# Altium project PCB_Project.PrjPcb
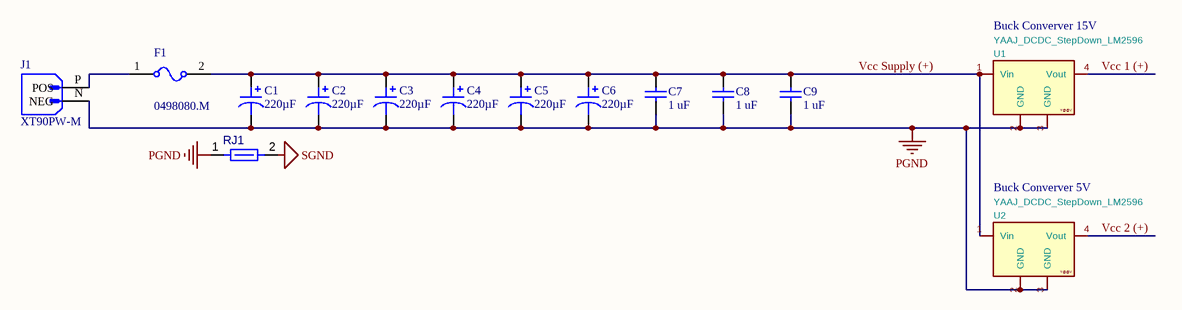
[diagram p0: Supply.SchDoc]
4 sheets, 72 parts. Net scope: global (net labels, ports and power ports of the same name join across sheets).
Board file: PCB.PcbDoc
Sheets:
  Supply.SchDoc
  Control.SchDoc
  Sensors.SchDoc
  Power.SchDoc

## Sheet Supply.SchDoc
size A4; SheetNumber: 1; SheetTotal: 4

### Parts
C1  220µF  [CAP TH ALUM ELEC D10.00mm S5.00mm H20.00mm]
C2  220µF  [CAP TH ALUM ELEC D10.00mm S5.00mm H20.00mm]
C3  220µF  [CAP TH ALUM ELEC D10.00mm S5.00mm H20.00mm]
C4  220µF  [CAP TH ALUM ELEC D10.00mm S5.00mm H20.00mm]
C5  220µF  [CAP TH ALUM ELEC D10.00mm S5.00mm H20.00mm]
C6  220µF  [CAP TH ALUM ELEC D10.00mm S5.00mm H20.00mm]
C7  1 uF  [CAPR51-254-508X318X736]
C8  1 uF  [CAPR51-254-508X318X736]
C9  1 uF  [CAPR51-254-508X318X736]
F1  0498080.M  [0498080M]
J1  XT90PW-M  [AMASS_XT90PW-M]
RJ1  Net Tie 0.6x1.4mm  [SHORT10_8MIL-FP]  (value not drawn)  (net tie, no BOM)
U1  Buck Converver 15V  value YAAJ_DCDC_StepDown_LM2596  [YAAJ_DCDC_StepDown_LM2596]
U2  Buck Converver 5V  value YAAJ_DCDC_StepDown_LM2596  [YAAJ_DCDC_StepDown_LM2596]

### Nets
PGND: C1.2 C2.2 C3.2 C4.2 C5.2 C6.2 C7.1 C8.1 C9.1 J1.N(NEG) RJ1.1 U1.2(GND) U1.3(GND) U2.2(GND) U2.3(GND)
SGND: RJ1.2
Vcc 1 (+): U1.4(Vout)
Vcc 2 (+): U2.4(Vout)
Vcc Supply (+): C1.1 C2.1 C3.1 C4.1 C5.1 C6.1 C7.2 C8.2 C9.2 F1.2 U1.1(Vin) U2.1(Vin)
NetF1_1: F1.1 J1.P(POS)

### Notes on the sheet
- (in symbol YAAJ_DCDC_StepDown_LM2596) Y@@V

### Library data of the parts
C1 C3-C6 = UPW1J221MPD: CAP ALUM 220UF 20% 63V RADIAL; manufacturer: Nichicon; Impedance: 147 mOhms; Lifetime @ Temp.: 5000 Hrs @ 105°C; Polarization: Polar; Ripple Current @ High Frequency: 885mA @ 100kHz; Ripple Current @ Low Frequency: 575.25mA @ 120Hz; Part Number: UPW1J221MPD; Applications: General Purpose; Capacitance: 220µF; componentlink1description: Datasheet; componentlink1url: http://nichicon-us.com/english/products/pdfs/e-upw.pdf; componentlink2description: DigiKey Link; componentlink2url: http://digikey.com/product-detail/en/nichicon/UPW1J221MPD/493-1942-ND/589683; Device Package: Radial, Can; Height - Seated (Max): 0.787" (20.00mm); lastupdated: 02/09/2020 01:31:30; Lead Spacing: 0.197" (5.00mm); Lifecycle Status: Active; Minimum Order: 1; Mounting Type: Through Hole; Operating Temperature: -55°C ~ 105°C; Package / Case: Radial, Can; packaging: Bulk; partid: 12422; Part Status: Active; price: 0.65; series: UPW; Size / Dimension: 0.394" Dia (10.00mm); Supplier 1: DigiKey; Supplier Part Number 1: 493-1942-ND; Tolerance: ±20%; value: 220µF; Voltage - Rated: 63V
C2 = UPW1J221MPD: UPW1J221MPD / CAP ALUM 220UF 20% 63V RADIAL; manufacturer: Nichicon; Impedance: 147 mOhms; Lifetime @ Temp.: 5000 Hrs @ 105°C; Polarization: Polar; Ripple Current @ High Frequency: 885mA @ 100kHz; Ripple Current @ Low Frequency: 575.25mA @ 120Hz; Part Number: UPW1J221MPD; Applications: General Purpose; Capacitance: 220µF; componentlink1description: Datasheet; componentlink1url: http://nichicon-us.com/english/products/pdfs/e-upw.pdf; componentlink2description: DigiKey Link; componentlink2url: http://digikey.com/product-detail/en/nichicon/UPW1J221MPD/493-1942-ND/589683; Device Package: Radial, Can; Height - Seated (Max): 0.787" (20.00mm); lastupdated: 02/09/2020 01:31:30; Lead Spacing: 0.197" (5.00mm); Lifecycle Status: Active; Minimum Order: 1; Mounting Type: Through Hole; Operating Temperature: -55°C ~ 105°C; Package / Case: Radial, Can; packaging: Bulk; partid: 12422; Part Status: Active; price: 0.65; series: UPW; Size / Dimension: 0.394" Dia (10.00mm); Supplier 1: DigiKey; Supplier Part Number 1: 493-1942-ND; Tolerance: ±20%; value: 220µF; Voltage - Rated: 63V
C7-C9 = CMP-1664-00004-1: Radial Leaded Multilayer Ceramic Capacitor, 0.1 uF, +/- 10%, 50 V, -55 to 125 degC, 2-Pin THD, RoHS, Tape and Reel; Case\Package: SOT-23-5; Max Power Dissipation: 250 mW; Output Current: 150 mA; Dropout Voltage: 260 mV; Outputs: 1; Output Voltage: 5 V; Max Input Voltage: 8 V; Min Operating Temperature: -40 degC; Packaging: Tape and Reel; Height: 1.3 mm; Radiation Hardening: No; Pins: 5; ComponentLink1Description: Manufacturer URL; Mount: Surface Mount; RoHSCompliant: true; Max Operating Temperature: 85 degC; PackageReference: CAPR51-254-508X318X736; ComponentLink2URL: http://www.kemet.com/docfinder?Partnumber=C320C104K5R5TA; PackageDescription: 2-Pin Through Hole Device, Body 5.08 x 3.18 mm, Pitch 2.54 mm; ComponentLink1URL: http://www.kemet.com/; Width: 1.8 mm; Package Quantity: 3000; DatasheetVersion: Dec-15; Length: 3 mm; ComponentLink2Description: Datasheet
F1 = Fuse: 80 A 32 V Fuse Automotive Bolt Mount Auto Link; RESISTANCE: 1m; SimulationGenericComponent: True; CURRENT: 80
J1 = XT90PW-M: Socket; DC supply; XT90; male; PIN: 2; on PCBs; THT; Colour: yellow; MF: AMASS; SnapEDA_Link: https://www.snapeda.com/parts/XT90PW-M/AMASS/view-part/?ref=snap; Package: Package; Value: *; MP: XT90PW-M; Check_prices: https://www.snapeda.com/parts/XT90PW-M/AMASS/view-part/?ref=eda
RJ1 = CMP-009-00120-2: Max Operating Temperature: 155°C; Min Operating Temperature: -55°C; Pins: 2
U1 U2 = YAAJ_DCDC_StepDown_LM2596

## Sheet Control.SchDoc
size A4; SheetNumber: 2; SheetTotal: 4
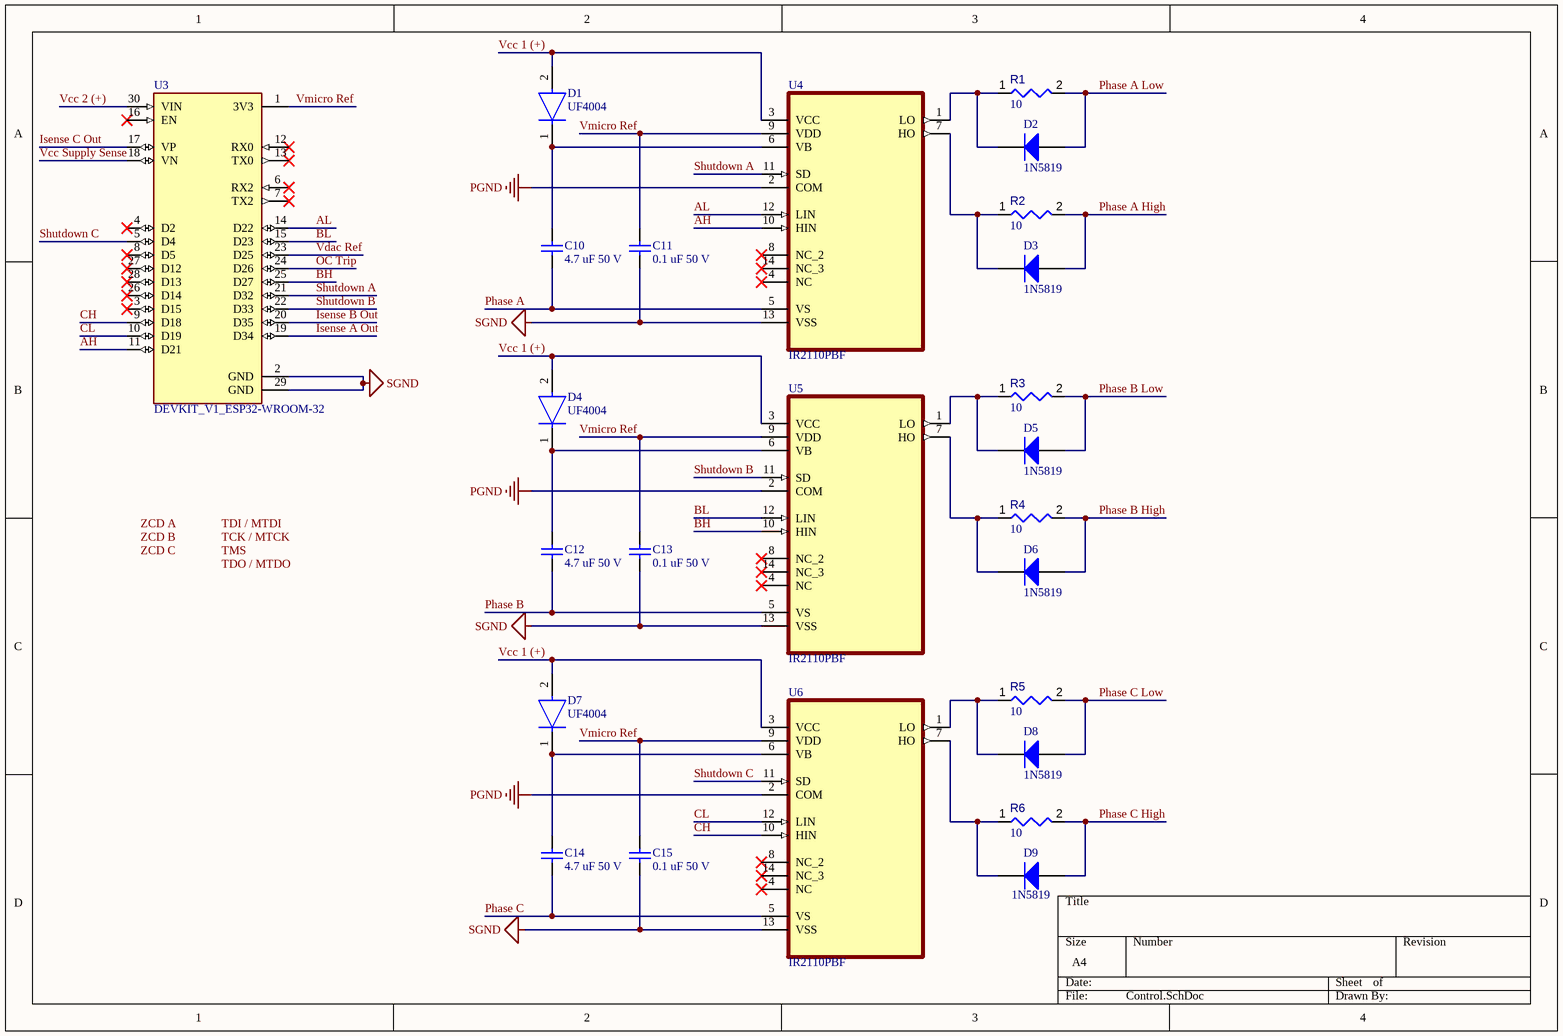
[diagram p1: Control.SchDoc]

### Parts
C10  4.7 uF 50 V  [CAPR51-254-508X318X736]
C11  0.1 uF 50 V  [CAPR51-254-508X318X736]
C12  4.7 uF 50 V  [CAPR51-254-508X318X736]
C13  0.1 uF 50 V  [CAPR51-254-508X318X736]
C14  4.7 uF 50 V  [CAPR51-254-508X318X736]
C15  0.1 uF 50 V  [CAPR51-254-508X318X736]
D1  UF4004  [FP-017AH-MFG]
D2  1N5819  [ONSC-AXIAL_LEAD-2-59-10_P]
D3  1N5819  [ONSC-AXIAL_LEAD-2-59-10_P]
D4  UF4004  [FP-017AH-MFG]
D5  1N5819  [ONSC-AXIAL_LEAD-2-59-10_P]
D6  1N5819  [ONSC-AXIAL_LEAD-2-59-10_P]
D7  UF4004  [FP-017AH-MFG]
D8  1N5819  [ONSC-AXIAL_LEAD-2-59-10_P]
D9  1N5819  [ONSC-AXIAL_LEAD-2-59-10_P]
R1  value 10  [RESA60-630X240]  (hidden comment: MFR-25FBF52-10R)
R2  value 10  [RESA60-630X240]  (hidden comment: MFR-25FBF52-10R)
R3  value 10  [RESA60-630X240]  (hidden comment: MFR-25FBF52-10R)
R4  value 10  [RESA60-630X240]  (hidden comment: MFR-25FBF52-10R)
R5  value 10  [RESA60-630X240]  (hidden comment: MFR-25FBF52-10R)
R6  value 10  [RESA60-630X240]  (hidden comment: MFR-25FBF52-10R)
U3  DEVKIT_V1_ESP32-WROOM-32  [MODULE_DEVKIT_V1_ESP32-WROOM-32]
U4  IR2110PBF  [DIP254P762X533-14]
U5  IR2110PBF  [DIP254P762X533-14]
U6  IR2110PBF  [DIP254P762X533-14]

### Nets
PGND: U4.2(COM) U5.2(COM) U6.2(COM)
SGND: C11.1 C13.1 C15.1 U3.2(GND) U3.29(GND) U4.13(VSS) U5.13(VSS) U6.13(VSS)
AH: U3.11(D21) U4.10(HIN)
AL: U3.14(D22) U4.12(LIN)
BH: U3.25(D27) U5.10(HIN)
BL: U3.15(D23) U5.12(LIN)
CH: U3.9(D18) U6.10(HIN)
CL: U3.10(D19) U6.12(LIN)
Isense A Out: U3.19(D34)
Isense B Out: U3.20(D35)
Isense C Out: U3.17(VP)
OC Trip: U3.24(D26)
Phase A: C10.1 U4.5(VS)
Phase A High: D3.1(A) R2.2
Phase A Low: D2.1(A) R1.2
Phase B: C12.1 U5.5(VS)
Phase B High: D6.1(A) R4.2
Phase B Low: D5.1(A) R3.2
Phase C: C14.1 U6.5(VS)
Phase C High: D9.1(A) R6.2
Phase C Low: D8.1(A) R5.2
Shutdown A: U3.21(D32) U4.11(SD)
Shutdown B: U3.22(D33) U5.11(SD)
Shutdown C: U3.5(D4) U6.11(SD)
Vcc 1 (+): D1.2(A) D4.2(A) D7.2(A) U4.3(VCC) U5.3(VCC) U6.3(VCC)
Vcc 2 (+): U3.30(VIN)
Vcc Supply Sense: U3.18(VN)
Vdac Ref: U3.23(D25)
Vmicro Ref: C11.2 C13.2 C15.2 U3.1(3V3) U4.9(VDD) U5.9(VDD) U6.9(VDD)
NetC10_2: C10.2 D1.1(C) U4.6(VB)
NetC12_2: C12.2 D4.1(C) U5.6(VB)
NetC14_2: C14.2 D7.1(C) U6.6(VB)
NetD2_2: D2.2(K) R1.1 U4.1(LO)
NetD3_2: D3.2(K) R2.1 U4.7(HO)
NetD5_2: D5.2(K) R3.1 U5.1(LO)
NetD6_2: D6.2(K) R4.1 U5.7(HO)
NetD8_2: D8.2(K) R5.1 U6.1(LO)
NetD9_2: D9.2(K) R6.1 U6.7(HO)

Not connected (* = marked no-connect by the designer): U3 3(D15)* 4(D2)* 6(RX2)* 7(TX2)* 8(D5)* 12(RX0)* 13(TX0)* 16(EN)* 26(D14)* 27(D12)* 28(D13)*; U4 4(NC)* 8(NC_2)* 14(NC_3)*; U5 4(NC)* 8(NC_2)* 14(NC_3)*; U6 4(NC)* 8(NC_2)* 14(NC_3)*

### Notes on the sheet
- Labels drawn without touching a wire or pin: TCK / MTCK, TDI / MTDI, TDO / MTDO, TMS, ZCD A, ZCD B, ZCD C

### Library data of the parts
C10-C15 = CMP-1664-00004-1: as C7 on sheet Supply; Min Operating Temperature: -40 degC; Packaging: Tape and Reel; Height: 1.3 mm; Radiation Hardening: No; Pins: 5; ComponentLink1Description: Manufacturer URL; Mount: Surface Mount; RoHSCompliant: true; Max Operating Temperature: 85 degC; PackageReference: CAPR51-254-508X318X736; ComponentLink2URL: http://www.kemet.com/docfinder?Partnumber=C320C104K5R5TA; PackageDescription: 2-Pin Through Hole Device, Body 5.08 x 3.18 mm, Pitch 2.54 mm; ComponentLink1URL: http://www.kemet.com/; Width: 1.8 mm; Package Quantity: 3000; DatasheetVersion: Dec-15; Length: 3 mm; ComponentLink2Description: Datasheet
D1 D4 D7 = CMP-00278-84331690-1: UF4004 Rectifier Diode, 1 Phase, 1 Element, 1A, 400V V(RRM), Silicon, DO-41; Manufacturer Lifecycle Status: ACTIVE, NOT REC; Max Surge Current: 30A; Power Dissipation: 2.08W; Max Junction Temperature (Tj): 150°C; Element Configuration: Single; Capacitance: 17pF; Recovery Time: 50ns; Forward Voltage: 1V; Polarity: Standard; Peak Reverse Current: 10µA; Max Repetitive Reverse Voltage (Vrrm): 400V; Max Operating Temperature: 150°C; Lead Free: Lead Free; Output Current: 1A; Min Operating Temperature: -65°C; Reverse Voltage: 400V; Lifecycle Status: NRND; Peak Non-Repetitive Surge Current: 30A; Height: 2.72mm; Packaging: Cut Tape; REACH SVHC: No SVHC; Number of Pins: 2; Max Reverse Voltage (DC): 400V; NexarPartId: 84331690; Radiation Hardening: No; Current Rating: 1A; Length: 5.2mm; Average Rectified Current: 1A; Forward Current: 1A; Width: 6.35mm; Reverse Recovery Time: 50ns; Mount: Through Hole; Weight: 245mg; RoHS: Compliant; Voltage Rating (DC): 400V; Schedule B: 8541100080, 8541100080; Diameter: 2.72mm; Max Forward Surge Current (Ifsm): 30A; Contact Plating: Tin
D2 D3 D5 D6 D8 D9 = CMP-004-00009-2: Low Drop Power Schottky Rectifier, 40 V, 1 A, 2-Pin DO-41, RoHS; Manufacturer: ON Semiconductor; Max Surge Current: 25A; Forward Current: 1A; Package Version: Rev. U, 02/2005; Peak Reverse Current: 1mA; Max Operating Temperature: 125°C; Case/Package: DO; Package URL: http://www.onsemi.cn/pub_link/Collateral/59-10.PDF; Packaging: Bulk; Manufacturer URL: http://www.onsemi.com/; Min Operating Temperature: -65°C; Package Description: 2-Pin, Axial Lead, Diameter 2.35 mm; Mounting Technology: TH; Datasheet URL: http://www.onsemi.cn/pub_link/Collateral/1N5817-D.PDF; Datasheet Version: Rev. 10, 07/2006; Package Reference: AXIAL_LEAD-2-59-10; Pins: 2; RoHS Compliant: True
R1-R6 = CMP-009-00048-4: 10 Ohms ±1% 0.25W, 1/4W Through Hole Resistor Axial Metal Film; Manufacturer: Yageo; Voltage Rating: 250V; Power: 250mW; Min Operating Temperature: -55°C; Max Operating Temperature: 155°C; Tolerance: 1%; Package Reference: MFR-25; Composition: CarbonFilm; Mounting Technology: TH; Packaging: Bulk; Case/Package: Axial; Datasheet URL: http://www.yageo.com/documents/recent/Yageo%20LR_MFR_2013.pdf; Package Quantity: 200; Manufacturer URL: http://www.yageo.com/; Package Description: 2-Pin Axial Lead, Dia 2.4 mm, Body Length 6.3 mm; Datasheet Version: Apr-13; RoHS Compliant: True
U3 = DEVKIT_V1_ESP32-WROOM-32: WROOM-32 Development Board ESP32 ESP-32S WiFi Bluetooth Dev Module; MF: Do it; MP: DEVKIT V1 ESP32-WROOM-32; SnapEDA_Link: https://www.snapeda.com/parts/DEVKIT%20V1%20ESP32-WROOM-32/Do+it/view-part/?ref=snap; Package: Package; Value: *; Check_prices: https://www.snapeda.com/parts/DEVKIT%20V1%20ESP32-WROOM-32/Do+it/view-part/?ref=eda
U4-U6 = IR2110PBF: High and Low Side Driver, All High Voltage Pins On One Side, Separate Logic and Power Ground, Shut-Down; MF: Infineon; Availability: In Stock; Value: *; Price: None; Check_prices: https://www.snapeda.com/parts/IR2110PBF/Infineon+Technologies/view-part/?ref=eda; Purchase-URL: https://pricing.snapeda.com/search/part/IR2110PBF/?ref=eda; SnapEDA_Link: https://www.snapeda.com/parts/IR2110PBF/Infineon+Technologies/view-part/?ref=snap; MP: IR2110PBF; Package: DIP-14 Infineon

## Sheet Sensors.SchDoc
size A4; SheetNumber: 3; SheetTotal: 4
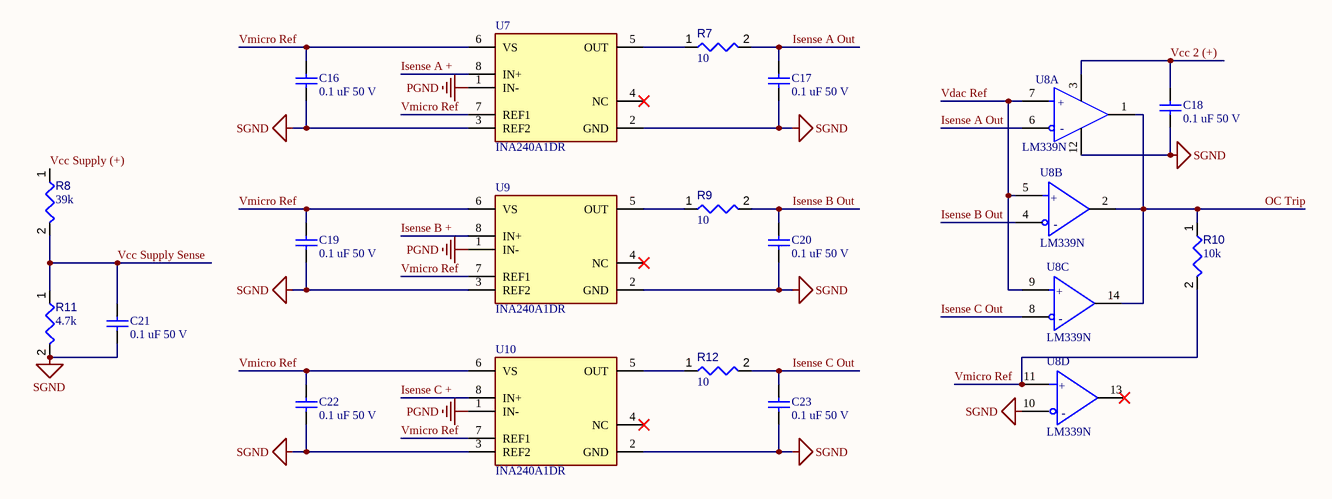
[diagram p2: Sensors.SchDoc]

### Parts
C16  0.1 uF 50 V  [CAPR51-254-508X318X736]
C17  0.1 uF 50 V  [CAPR51-254-508X318X736]
C18  0.1 uF 50 V  [CAPR51-254-508X318X736]
C19  0.1 uF 50 V  [CAPR51-254-508X318X736]
C20  0.1 uF 50 V  [CAPR51-254-508X318X736]
C21  0.1 uF 50 V  [CAPR51-254-508X318X736]
C22  0.1 uF 50 V  [CAPR51-254-508X318X736]
C23  0.1 uF 50 V  [CAPR51-254-508X318X736]
R7  value 10  [RESA60-630X240]  (hidden comment: MFR-25FBF52-10R)
R8  value 39k  [RESA60-630X240]  (hidden comment: MFR-25FBF52-39K)
R9  value 10  [RESA60-630X240]  (hidden comment: MFR-25FBF52-10R)
R10  value 10k  [RESA60-630X240]  (hidden comment: MFR-25FBF52-10K)
R11  value 4.7k  [RESA60-630X240]  (hidden comment: MFR-25FBF52-4K7)
R12  value 10  [RESA60-630X240]  (hidden comment: MFR-25FBF52-10R)
U7  INA240A1DR  [FP-D0008A-IPC_A]
U8  LM339N  [FP-N0014A-MFG]  (parts A,B,C,D of 4)
U9  INA240A1DR  [FP-D0008A-IPC_A]
U10  INA240A1DR  [FP-D0008A-IPC_A]

### Nets
PGND: U7.1(IN-) U9.1(IN-) U10.1(IN-)
SGND: C16.1 C17.1 C18.1 C19.1 C20.1 C21.1 C22.1 C23.1 R11.2 U7.2(GND) U7.3(REF2) U8.10(4IN-) U8.12(GND) U9.2(GND) U9.3(REF2) U10.2(GND) U10.3(REF2)
Isense A +: U7.8(IN+)
Isense A Out: C17.2 R7.2 U8.6(1IN-)
Isense B +: U9.8(IN+)
Isense B Out: C20.2 R9.2 U8.4(2IN-)
Isense C +: U10.8(IN+)
Isense C Out: C23.2 R12.2 U8.8(3IN-)
OC Trip: R10.1 U8.1(1OUT) U8.2(2OUT) U8.14(OUT3)
Vcc 2 (+): C18.2 U8.3(VCC)
Vcc Supply (+): R8.1
Vcc Supply Sense: C21.2 R8.2 R11.1
Vdac Ref: U8.5(2IN+) U8.7(1IN+) U8.9(3IN+)
Vmicro Ref: C16.2 C19.2 C22.2 R10.2 U7.6(VS) U7.7(REF1) U8.11(4IN+) U9.6(VS) U9.7(REF1) U10.6(VS) U10.7(REF1)
NetR7_1: R7.1 U7.5(OUT)
NetR9_1: R9.1 U9.5(OUT)
NetR12_1: R12.1 U10.5(OUT)

Not connected (* = marked no-connect by the designer): U7 4(NC)*; U8 13(OUT4)*; U9 4(NC)*; U10 4(NC)*

### Notes on the sheet
- (in symbol CMP-0055-00143-4, part A) +; -
- (in symbol CMP-0055-00143-4, part B) +; -
- (in symbol CMP-0055-00143-4, part C) +; -
- (in symbol CMP-0055-00143-4, part D) +; -

### Library data of the parts
C16-C23 = CMP-1664-00004-1: as C7 on sheet Supply; Min Operating Temperature: -40 degC; Packaging: Tape and Reel; Height: 1.3 mm; Radiation Hardening: No; Pins: 5; ComponentLink1Description: Manufacturer URL; Mount: Surface Mount; RoHSCompliant: true; Max Operating Temperature: 85 degC; PackageReference: CAPR51-254-508X318X736; ComponentLink2URL: http://www.kemet.com/docfinder?Partnumber=C320C104K5R5TA; PackageDescription: 2-Pin Through Hole Device, Body 5.08 x 3.18 mm, Pitch 2.54 mm; ComponentLink1URL: http://www.kemet.com/; Width: 1.8 mm; Package Quantity: 3000; DatasheetVersion: Dec-15; Length: 3 mm; ComponentLink2Description: Datasheet
R7 R9 R12 = CMP-009-00048-4: as R1 on sheet Control; Min Operating Temperature: -55°C; Max Operating Temperature: 155°C; Tolerance: 1%; Package Reference: MFR-25; Composition: CarbonFilm; Mounting Technology: TH; Packaging: Bulk; Case/Package: Axial; Datasheet URL: http://www.yageo.com/documents/recent/Yageo%20LR_MFR_2013.pdf; Package Quantity: 200; Manufacturer URL: http://www.yageo.com/; Package Description: 2-Pin Axial Lead, Dia 2.4 mm, Body Length 6.3 mm; Datasheet Version: Apr-13; RoHS Compliant: True
R8 = CMP-009-00048-4: 39 kOhms ±1% 0.25W, 1/4W Through Hole Resistor Axial Metal Film; Manufacturer: Yageo; Voltage Rating: 250V; Power: 250mW; Min Operating Temperature: -55°C; Max Operating Temperature: 155°C; Tolerance: 1%; Package Reference: MFR-25; Composition: CarbonFilm; Mounting Technology: TH; Packaging: Bulk; Case/Package: Axial; Datasheet URL: http://www.yageo.com/documents/recent/Yageo%20LR_MFR_2013.pdf; Package Quantity: 200; Manufacturer URL: http://www.yageo.com/; Package Description: 2-Pin Axial Lead, Dia 2.4 mm, Body Length 6.3 mm; Datasheet Version: Apr-13; RoHS Compliant: True
R10 = CMP-009-00048-4: 10 kOhms ±1% 0.25W, 1/4W Through Hole Resistor Axial Metal Film; Manufacturer: Yageo; Voltage Rating: 250V; Power: 250mW; Min Operating Temperature: -55°C; Max Operating Temperature: 155°C; Tolerance: 1%; Package Reference: MFR-25; Composition: CarbonFilm; Mounting Technology: TH; Packaging: Bulk; Case/Package: Axial; Datasheet URL: http://www.yageo.com/documents/recent/Yageo%20LR_MFR_2013.pdf; Package Quantity: 200; Manufacturer URL: http://www.yageo.com/; Package Description: 2-Pin Axial Lead, Dia 2.4 mm, Body Length 6.3 mm; Datasheet Version: Apr-13; RoHS Compliant: True
R11 = CMP-009-00048-4: 4.7 kOhms ±1% 0.25W, 1/4W Through Hole Resistor Axial Metal Film; Manufacturer: Yageo; Voltage Rating: 250V; Power: 250mW; Min Operating Temperature: -55°C; Max Operating Temperature: 155°C; Tolerance: 1%; Package Reference: MFR-25; Composition: CarbonFilm; Mounting Technology: TH; Packaging: Bulk; Case/Package: Axial; Datasheet URL: http://www.yageo.com/documents/recent/Yageo%20LR_MFR_2013.pdf; Package Quantity: 200; Manufacturer URL: http://www.yageo.com/; Package Description: 2-Pin Axial Lead, Dia 2.4 mm, Body Length 6.3 mm; Datasheet Version: Apr-13; RoHS Compliant: True
U7 U9 U10 = CMP-04895-000179-1: IC CURR SENSE 1 CIRCUIT 8SOIC; Slew Rate: 2V/µs; -3db Bandwidth: 400kHz; Input Bias Current: 90uA; Operating Supply Current: 1.8mA; Input Offset Voltage (Vos): 5uV; Number of Circuits: 1; Mount: Surface Mount; Packaging: Cut Tape; Max Operating Temperature: 125°C; Case/Package: SOIC; Min Operating Temperature: -40°C; RoHS Compliant: Yes; Number of Pins: 8
U8 = CMP-0055-00143-4: IC QUAD DIFF COMPARATOR 14-DIP; Power Dissipation: 1.05kW; Response Time: 1.3us; Max Input Current: 250nA; Max Supply Current: 500uA; Output Current: 20mA; Output Type: TTL; Max Dual Supply Voltage: 15V; Voltage Gain: 106.02dB; Min Supply Voltage: 2V; Max Power Dissipation: 1.05W; Quiescent Current: 2.5mA; Nominal Supply Current: 2mA; Input Offset Voltage (Vos): 5mV; Number of Channels: 4; Output Current per Channel: 6mA; Max Supply Voltage: 30V; Min Dual Supply Voltage: 1V; Dual Supply Voltage: 9V; REACH SVHC: No SVHC; Max Operating Temperature: 70°C; Case/Package: PDIP; Weight: 0.032734oz; Radiation Hardening: No; Min Operating Temperature: 0°C; Number of Pins: 14; Contact Plating: Gold; Package Quantity: 25; Lead Free: Lead Free; Height: 4.57mm; Packaging: Rail/Tube; Input Bias Current: 250nA; Number of Elements: 4; Mount: Through Hole; Width: 6.35mm; Length: 19.3mm

## Sheet Power.SchDoc
size A4; SheetNumber: 4; SheetTotal: 4
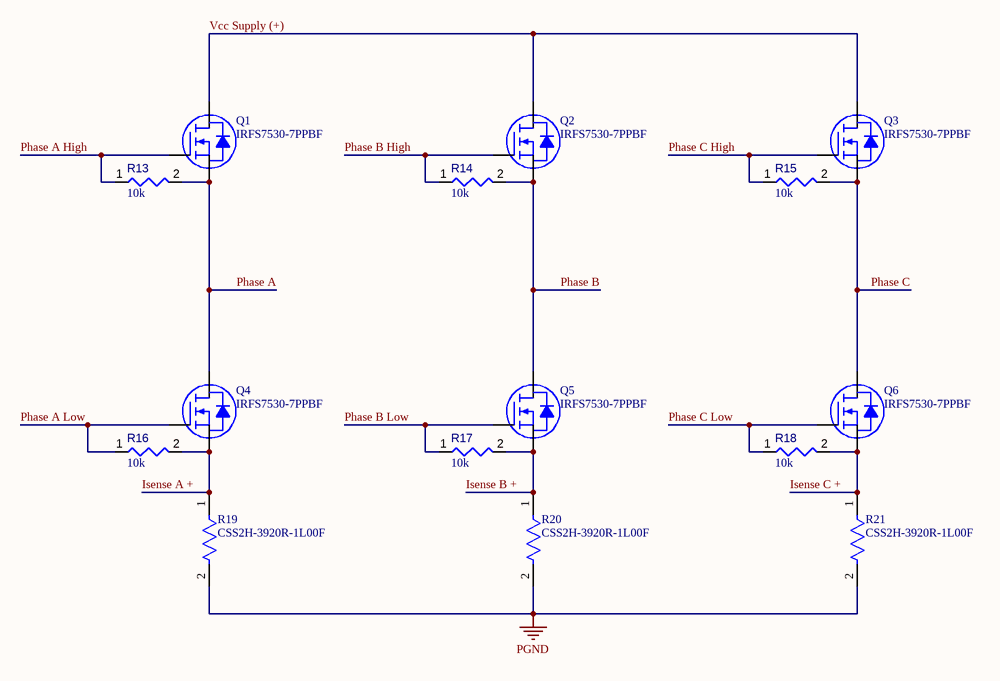
[diagram p3: Power.SchDoc]

### Parts
Q1  IRFS7530-7PPBF  [INFINEON TO-263-7]
Q2  IRFS7530-7PPBF  [INFINEON TO-263-7]
Q3  IRFS7530-7PPBF  [INFINEON TO-263-7]
Q4  IRFS7530-7PPBF  [INFINEON TO-263-7]
Q5  IRFS7530-7PPBF  [INFINEON TO-263-7]
Q6  IRFS7530-7PPBF  [INFINEON TO-263-7]
R13  value 10k  [RESA60-630X240]  (hidden comment: MFR-25FBF52-10K)
R14  value 10k  [RESA60-630X240]  (hidden comment: MFR-25FBF52-10K)
R15  value 10k  [RESA60-630X240]  (hidden comment: MFR-25FBF52-10K)
R16  value 10k  [RESA60-630X240]  (hidden comment: MFR-25FBF52-10K)
R17  value 10k  [RESA60-630X240]  (hidden comment: MFR-25FBF52-10K)
R18  value 10k  [RESA60-630X240]  (hidden comment: MFR-25FBF52-10K)
R19  CSS2H-3920R-1L00F  [FP-CSS2H-3920R-1L00F-MFG]
R20  CSS2H-3920R-1L00F  [FP-CSS2H-3920R-1L00F-MFG]
R21  CSS2H-3920R-1L00F  [FP-CSS2H-3920R-1L00F-MFG]

### Nets
PGND: R19.2 R20.2 R21.2
Isense A +: Q4.2(S) Q4.3(S) Q4.5(S) Q4.6(S) Q4.7(S) R16.2 R19.1
Isense B +: Q5.2(S) Q5.3(S) Q5.5(S) Q5.6(S) Q5.7(S) R17.2 R20.1
Isense C +: Q6.2(S) Q6.3(S) Q6.5(S) Q6.6(S) Q6.7(S) R18.2 R21.1
Phase A: Q1.2(S) Q1.3(S) Q1.5(S) Q1.6(S) Q1.7(S) Q4.8(D) R13.2
Phase A High: Q1.1(G) R13.1
Phase A Low: Q4.1(G) R16.1
Phase B: Q2.2(S) Q2.3(S) Q2.5(S) Q2.6(S) Q2.7(S) Q5.8(D) R14.2
Phase B High: Q2.1(G) R14.1
Phase B Low: Q5.1(G) R17.1
Phase C: Q3.2(S) Q3.3(S) Q3.5(S) Q3.6(S) Q3.7(S) Q6.8(D) R15.2
Phase C High: Q3.1(G) R15.1
Phase C Low: Q6.1(G) R18.1
Vcc Supply (+): Q1.8(D) Q2.8(D) Q3.8(D)

### Library data of the parts
Q1-Q6 = IRFS7530TRL7PP: MOSFET N CH 60V 240A D2PAK; Manufacturer: Infineon Technologies; Current - Continuous Drain (Id) @ 25°C: 240A (Tc); Drive Voltage (Max Rds On,  Min Rds On): 6V, 10V; FET Type: N-Channel; Gate Charge (Qg) (Max) @ Vgs: 354 nC @ 10 V; Input Capacitance (Ciss) (Max) @ Vds: 12960 pF @ 25 V; Power Dissipation (Max): 375W (Tc); Rds On (Max) @ Id, Vgs: 1.4mOhm @ 100A, 10V; Vgs (Max): ±20V; Vgs(th) (Max) @ Id: 3.7V @ 250µA; Part Number: IRFS7530TRL7PP; ComponentLink1Description: Datasheet; ComponentLink1URL: https://www.infineon.com/dgdl/irfs7530-7ppbf.pdf?fileId=5546d462533600a40153563a9d1e21d8; ComponentLink2Description: DigiKey Link; ComponentLink2URL: https://www.digikey.com/en/products/detail/infineon-technologies/IRFS7530TRL7PP/4772498; Drain to Source Voltage (Vdss): 60 V; LastUpdated: 01/04/2026 21:01:32; Lifecycle Status: Active; Minimum Order: 1; Mounting Type: Surface Mount; Operating Temperature: -55°C ~ 175°C (TJ); Package / Case: TO-263-7, D²Pak (6 Leads + Tab); Packaging: TapeAndReel; Part Status: Active; Price: 1.59; Series: HEXFET®, StrongIRFET™; Supplier 1: DigiKey; Supplier Part Number 1: IRFS7530TRL7PPCT-ND; Supplier Device Package: PG-TO263-7; Technology: MOSFET (Metal Oxide)
R13-R18 = CMP-009-00048-4: as R10 on sheet Sensors; Min Operating Temperature: -55°C; Max Operating Temperature: 155°C; Tolerance: 1%; Package Reference: MFR-25; Composition: CarbonFilm; Mounting Technology: TH; Packaging: Bulk; Case/Package: Axial; Datasheet URL: http://www.yageo.com/documents/recent/Yageo%20LR_MFR_2013.pdf; Package Quantity: 200; Manufacturer URL: http://www.yageo.com/; Package Description: 2-Pin Axial Lead, Dia 2.4 mm, Body Length 6.3 mm; Datasheet Version: Apr-13; RoHS Compliant: True
R19-R21 = CMP-07231-006016-1: RES 0.001 OHM 1% 8W 3920; Temperature Coefficient: 50ppm/°C; Resistance: 1mR; Length: 0.394inch; Height: 0.02inch; RoHS Compliant: Yes; Packaging: Cut Tape; Case/Package: 3920; Width: 0.205inch; Features: Moisture Resistant; Case Code (Imperial): 3920; Case Code (Metric): 1052; Min Operating Temperature: -55°C; Tolerance: 1%; Power Rating: 8W; Resistor Type: Metal Element; Max Power Dissipation: 8W; REACH SVHC: No SVHC; Max Operating Temperature: 170°C; Number of Terminations: 2

## Nets that join several sheets
PGND: Supply (15 pins), Control (U4.2 U5.2 U6.2), Sensors (U7.1 U9.1 U10.1), Power (R19.2 R20.2 R21.2)
SGND: Supply (RJ1.2), Control (8 pins), Sensors (17 pins)
Isense A +: Sensors (U7.8), Power (7 pins)
Isense A Out: Control (U3.19), Sensors (C17.2 R7.2 U8.6)
Isense B +: Sensors (U9.8), Power (7 pins)
Isense B Out: Control (U3.20), Sensors (C20.2 R9.2 U8.4)
Isense C +: Sensors (U10.8), Power (7 pins)
Isense C Out: Control (U3.17), Sensors (C23.2 R12.2 U8.8)
OC Trip: Control (U3.24), Sensors (R10.1 U8.1 U8.2 U8.14)
Phase A: Control (C10.1 U4.5), Power (7 pins)
Phase A High: Control (D3.1 R2.2), Power (Q1.1 R13.1)
Phase A Low: Control (D2.1 R1.2), Power (Q4.1 R16.1)
Phase B: Control (C12.1 U5.5), Power (7 pins)
Phase B High: Control (D6.1 R4.2), Power (Q2.1 R14.1)
Phase B Low: Control (D5.1 R3.2), Power (Q5.1 R17.1)
Phase C: Control (C14.1 U6.5), Power (7 pins)
Phase C High: Control (D9.1 R6.2), Power (Q3.1 R15.1)
Phase C Low: Control (D8.1 R5.2), Power (Q6.1 R18.1)
Vcc 1 (+): Supply (U1.4), Control (6 pins)
Vcc 2 (+): Supply (U2.4), Control (U3.30), Sensors (C18.2 U8.3)
Vcc Supply (+): Supply (12 pins), Sensors (R8.1), Power (Q1.8 Q2.8 Q3.8)
Vcc Supply Sense: Control (U3.18), Sensors (C21.2 R8.2 R11.1)
Vdac Ref: Control (U3.23), Sensors (U8.5 U8.7 U8.9)
Vmicro Ref: Control (7 pins), Sensors (11 pins)